# EAGLE schematic untitled (EAGLE 9.6.2)
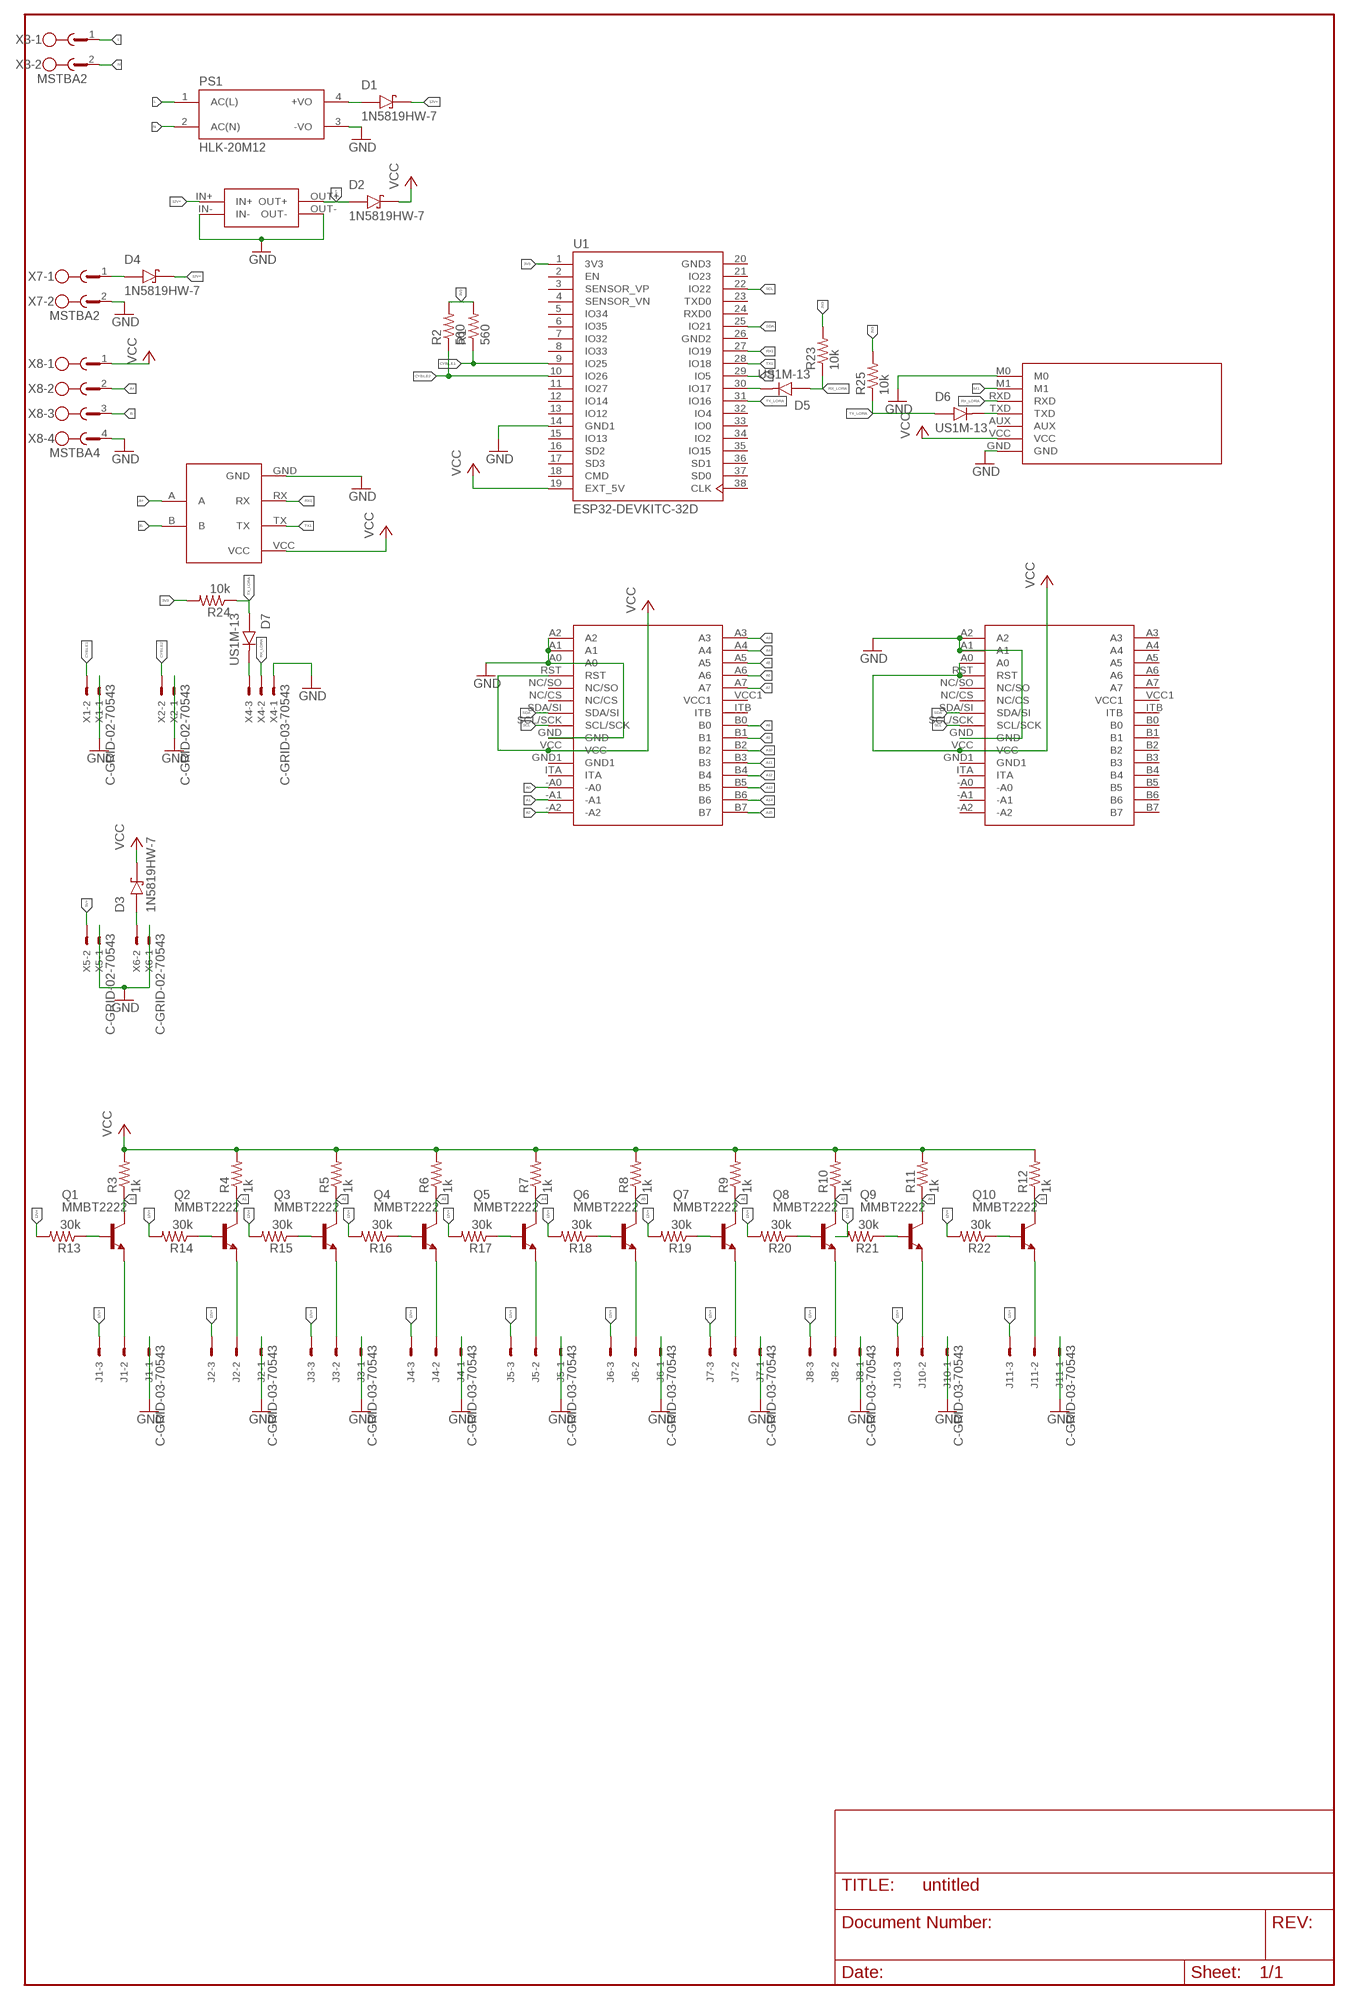
[diagram p0: schematic, sheet 1]

## Parts
D1  1N5819HW-7  [SOD3715X145N]
D2  1N5819HW-7  [SOD3715X145N]
D3  1N5819HW-7  [SOD3715X145N]
D4  1N5819HW-7  [SOD3715X145N]
D5  US1M-13  [DIOM5226X240N]
D6  US1M-13  [DIOM5226X240N]
D7  US1M-13  [DIOM5226X240N]
EBYTEE220-900T22D1  EBYTEE220-900T22D  [EBYTEE220-900T22D]
J1  C-GRID-03-70543  [70543-03]
J2  C-GRID-03-70543  [70543-03]
J3  C-GRID-03-70543  [70543-03]
J4  C-GRID-03-70543  [70543-03]
J5  C-GRID-03-70543  [70543-03]
J6  C-GRID-03-70543  [70543-03]
J7  C-GRID-03-70543  [70543-03]
J8  C-GRID-03-70543  [70543-03]
J10  C-GRID-03-70543  [70543-03]
J11  C-GRID-03-70543  [70543-03]
MCP1  MCP23017  [MCP23017]
MCP2  MCP23017  [MCP23017]
MINI1  MINI560  [MINI560]
PS1  HLK-20M12  [CONV_HLK-20M12]
Q1  MMBT2222  [SOT23-BEC]
Q2  MMBT2222  [SOT23-BEC]
Q3  MMBT2222  [SOT23-BEC]
Q4  MMBT2222  [SOT23-BEC]
Q5  MMBT2222  [SOT23-BEC]
Q6  MMBT2222  [SOT23-BEC]
Q7  MMBT2222  [SOT23-BEC]
Q8  MMBT2222  [SOT23-BEC]
Q9  MMBT2222  [SOT23-BEC]
Q10  MMBT2222  [SOT23-BEC]
R1  560  R-US_M0805  [M0805]
R2  560  R-US_M0805  [M0805]
R3  1k  R-US_M0805  [M0805]
R4  1k  R-US_M0805  [M0805]
R5  1k  R-US_M0805  [M0805]
R6  1k  R-US_M0805  [M0805]
R7  1k  R-US_M0805  [M0805]
R8  1k  R-US_M0805  [M0805]
R9  1k  R-US_M0805  [M0805]
R10  1k  R-US_M0805  [M0805]
R11  1k  R-US_M0805  [M0805]
R12  1k  R-US_M0805  [M0805]
R13  30k  R-US_M0805  [M0805]
R14  30k  R-US_M0805  [M0805]
R15  30k  R-US_M0805  [M0805]
R16  30k  R-US_M0805  [M0805]
R17  30k  R-US_M0805  [M0805]
R18  30k  R-US_M0805  [M0805]
R19  30k  R-US_M0805  [M0805]
R20  30k  R-US_M0805  [M0805]
R21  30k  R-US_M0805  [M0805]
R22  30k  R-US_M0805  [M0805]
R23  10k  R-US_M0805  [M0805]
R24  10k  R-US_M0805  [M0805]
R25  10k  R-US_M0805  [M0805]
TTL-RS1  TTL-RS485  [TTL-RS485]
U1  ESP32-DEVKITC-32D  [MODULE_ESP32-DEVKITC-32D]
X1  C-GRID-02-70543  [70543-02]
X2  C-GRID-02-70543  [70543-02]
X3  MSTBA2  [MSTBA2]
X4  C-GRID-03-70543  [70543-03]
X5  C-GRID-02-70543  [70543-02]
X6  C-GRID-02-70543  [70543-02]
X7  MSTBA2  [MSTBA2]
X8  MSTBA4  [MSTBA4]

## Nets
3V3: R1.2 R2.2 R23.2 R24.2 R25.2 U1.1(3V3)
5V+: D2.A MINI1.OUT+ X5.2
12V+: D1.C(K) D4.C(K) J1.3 J2.3 J3.3 J4.3 J5.3 J6.3 J7.3 J8.3 J10.3 J11.3 MINI1.IN+ R13.2 R14.2 R15.2 R16.2 R17.2 R18.2 R19.2 R20.2 R21.2 R22.2
12V++: D1.A PS1.4(+VO)
A0: MCP1.-A0 Q1.C R3.1
A1: MCP1.-A1 Q2.C R4.1
A2: MCP1.-A2 Q3.C R5.1
A3: MCP1.A3 Q4.C R6.1
A4: MCP1.A4 Q5.C R7.1
A5: MCP1.A5 Q6.C R8.1
A6: MCP1.A6 Q7.C R9.1
A7: MCP1.A7 Q8.C R10.1
A8: MCP1.B0 Q9.C R11.1
A9: MCP1.B1 Q10.C R12.1
A10: MCP1.B2
A11: MCP1.B3
A12: MCP1.B4
A13: MCP1.B5
A14: MCP1.B6
A15: MCP1.B7
A+: TTL-RS1.A X8.2
B-: TTL-RS1.B X8.3
CYBLE1: R1.1 U1.9(IO25) X1.2
CYBLE2: R2.1 U1.10(IO26) X2.2
GND: EBYTEE220-900T22D1.GND EBYTEE220-900T22D1.M0 J1.1 J2.1 J3.1 J4.1 J5.1 J6.1 J7.1 J8.1 J10.1 J11.1 MCP1.A0 MCP1.A1 MCP1.A2 MCP1.GND MCP2.A1 MCP2.A2 MCP2.GND MINI1.IN- MINI1.OUT- PS1.3(-VO) TTL-RS1.GND U1.14(GND1) X1.1 X2.1 X4.1 X5.1 X6.1 X7.2 X8.4
L: PS1.1(AC(L)) X3.1
M1: EBYTEE220-900T22D1.M1 U1.29(IO5)
N: PS1.2(AC(N)) X3.2
N$1: Q1.B R13.1
N$2: Q2.B R14.1
N$3: D3.A X6.2
N$4: Q3.B R15.1
N$5: Q4.B R16.1
N$6: Q5.B R17.1
N$7: Q6.B R18.1
N$8: Q7.B R19.1
N$9: Q8.B R20.1
N$10: Q9.B R21.1
N$11: Q10.B R22.1
N$12: J1.2 Q1.E
N$13: J2.2 Q2.E
N$14: J3.2 Q3.E
N$15: J4.2 Q4.E
N$16: J5.2 Q5.E
N$17: J6.2 Q6.E
N$18: J7.2 Q7.E
N$19: J8.2 Q8.E
N$20: J10.2 Q9.E
N$21: J11.2 Q10.E
N$22: D4.A X7.1
N$23: D6.C(K) EBYTEE220-900T22D1.TXD
N$24: D5.C(K) U1.30(IO17)
N$25: D7.C(K) X4.3
RX1: TTL-RS1.RX U1.27(IO19)
RX_LORA: D5.A EBYTEE220-900T22D1.RXD R23.1 X4.2
SCL: MCP1.SCL/SCK MCP2.SCL/SCK U1.22(IO22)
SDA: MCP1.SDA/SI MCP2.SDA/SI U1.25(IO21)
TX1: TTL-RS1.TX U1.28(IO18)
TX_LORA: D6.A D7.A R24.1 R25.1 U1.31(IO16)
VCC: D2.C(K) D3.C(K) EBYTEE220-900T22D1.VCC MCP1.RST MCP1.VCC MCP2.A0 MCP2.RST MCP2.VCC R3.2 R4.2 R5.2 R6.2 R7.2 R8.2 R9.2 R10.2 R11.2 R12.2 TTL-RS1.VCC U1.19(EXT_5V) X8.1
Unconnected: EBYTEE220-900T22D1.AUX MCP1.GND1 MCP1.ITA MCP1.ITB MCP1.NC/CS MCP1.NC/SO MCP1.VCC1 MCP2.-A0 MCP2.-A1 MCP2.-A2 MCP2.A3 MCP2.A4 MCP2.A5 MCP2.A6 MCP2.A7 MCP2.B0 MCP2.B1 MCP2.B2 MCP2.B3 MCP2.B4 MCP2.B5 MCP2.B6 MCP2.B7 MCP2.GND1 MCP2.ITA MCP2.ITB MCP2.NC/CS MCP2.NC/SO MCP2.VCC1 U1.2(EN) U1.3(SENSOR_VP) U1.4(SENSOR_VN) U1.5(IO34) U1.6(IO35) U1.7(IO32) U1.8(IO33) U1.11(IO27) U1.12(IO14) U1.13(IO12) U1.15(IO13) U1.16(SD2) U1.17(SD3) U1.18(CMD) U1.21(IO23) U1.23(TXD0) U1.24(RXD0) U1.32(IO4) U1.33(IO0) U1.34(IO2) U1.35(IO15) U1.36(SD1) U1.37(SD0) U1.38(CLK)

## Power pins joined to a net without a drawn wire
GND2: U1.26(GND2)
GND3: U1.20(GND3)

## Library data of the parts
D1-D4 = 1N5819HW-7:1N5819HW-7: 1N5819HW Series 40 V 1 A Surface Mount Schottky Barrier Rectifier - SOD-123 Check availability <https://pricing.snapeda.com/parts/1N5819HW-7/Diodes%20Inc./view-part?ref=eda>; AVAILABILITY: In Stock; DESCRIPTION: Diode Schottky 40 V 1A Surface Mount SOD-123; MF: Diodes Inc.; MP: 1N5819HW-7; PACKAGE: SOD-123 Fairchild Semiconductor; PRICE: None; PURCHASE-URL: https://pricing.snapeda.com/search/part/1N5819HW-7/?ref=eda
D5-D7 = US1M-13:US1M-13: Diode, Fast Recovery, 1a, 1kv, Do-214ac-2, Full Reel Check availability <https://pricing.snapeda.com/parts/US1M-13/Diodes%20Incorporated/view-part?ref=eda>; AVAILABILITY: In Stock; DESCRIPTION: Diode Standard 1000 V 1A Surface Mount SMA; MF: Diodes Incorporated; MP: US1M-13; PACKAGE: DO-214AC-214 Diodes Incorporated; PRICE: None; PURCHASE-URL: https://pricing.snapeda.com/search/part/US1M-13/?ref=eda
EBYTEE220-900T22D1 = EByte E220-900T22D:EBYTEE220-900T22D
J1-J8 J10 J11 X4 = con-molex:C-GRID-03: CONNECTOR wire to board 2.54 mm (0.100") pitch header; MF: MOLEX; OC_FARNELL: unknown; OC_NEWARK: unknown
MCP1 MCP2 = mcp23017:MCP23017
MINI1 = MINI560:MINI560
PS1 = HLK-20M12:HLK-20M12: Check availability <https://pricing.snapeda.com/parts/HLK-20M12/Hi-link/view-part?ref=eda>; AVAILABILITY: Not in stock; CHECK_PRICES: https://www.snapeda.com/parts/HLK-20M12/Hi-link/view-part/?ref=eda; DESCRIPTION: 20W ultra-small series module power supply; MF: Hi-link; MP: HLK-20M12; PACKAGE: Non-Standard Hi-link; PRICE: None; SNAPEDA_LINK: https://www.snapeda.com/parts/HLK-20M12/Hi-link/view-part/?ref=snap
Q1-Q10 = MMBT2222_:MMBT2222*: NPN Transistor Check availability <https://pricing.snapeda.com/parts/MMBT2222/ON%20Semiconductor/view-part?ref=eda>; AVAILABILITY: In Stock; CHECK_PRICES: https://www.snapeda.com/parts/MMBT2222/Onsemi/view-part/?ref=eda; DESCRIPTION: Bipolar (BJT) Transistor NPN 30 V 600 mA 250MHz 300 mW Surface Mount SOT-23-3 (TO-236); MF: ON Semiconductor; MP: MMBT2222; PACKAGE: SOT-23-3 Fairchild Semiconductor; PRICE: None; SNAPEDA_LINK: https://www.snapeda.com/parts/MMBT2222/Onsemi/view-part/?ref=snap
R1-R25 = rcl:R-US_: RESISTOR, American symbol; SPICEPREFIX: R
TTL-RS1 = TTL-RS485:TTL-RS485
U1 = ESP32-DEVKITC-32D:ESP32-DEVKITC-32D: Eval Board For Esp-Wroom-32 Check availability <https://pricing.snapeda.com/parts/ESP32-DEVKITC-32D/Espressif%20Systems/view-part?ref=eda>; AVAILABILITY: In Stock; DESCRIPTION: WiFi Development Tools (802.11) ESP32 General Development Kit, ESP32-WROOM-32D on the board; MF: Espressif Systems; MP: ESP32-DEVKITC-32D; PACKAGE: None; PRICE: None; PURCHASE-URL: https://pricing.snapeda.com/search/part/ESP32-DEVKITC-32D/?ref=eda
X1 X2 X5 X6 = con-molex:C-GRID-02: CONNECTOR wire to board 2.54 mm (0.100") pitch header; MF: MOLEX; OC_FARNELL: unknown; OC_NEWARK: unknown
X3 X7 = con-phoenix-508:MSTBA2: PHOENIX; MF: FARNELL; MPN: 1757242; OC_FARNELL: 3705171; OC_NEWARK: 71C4161
X8 = con-phoenix-508:MSTBA4: PHOENIX; MF: FARNELL; MPN: 1757268; OC_FARNELL: 3705195; OC_NEWARK: 71C4163